# EAGLE schematic Adafrfuit PyBadge (EAGLE 9.2.2)
COMPANY: ADAFRUIT INDUSTRIES; DRAWN: KTOWN; REV: B
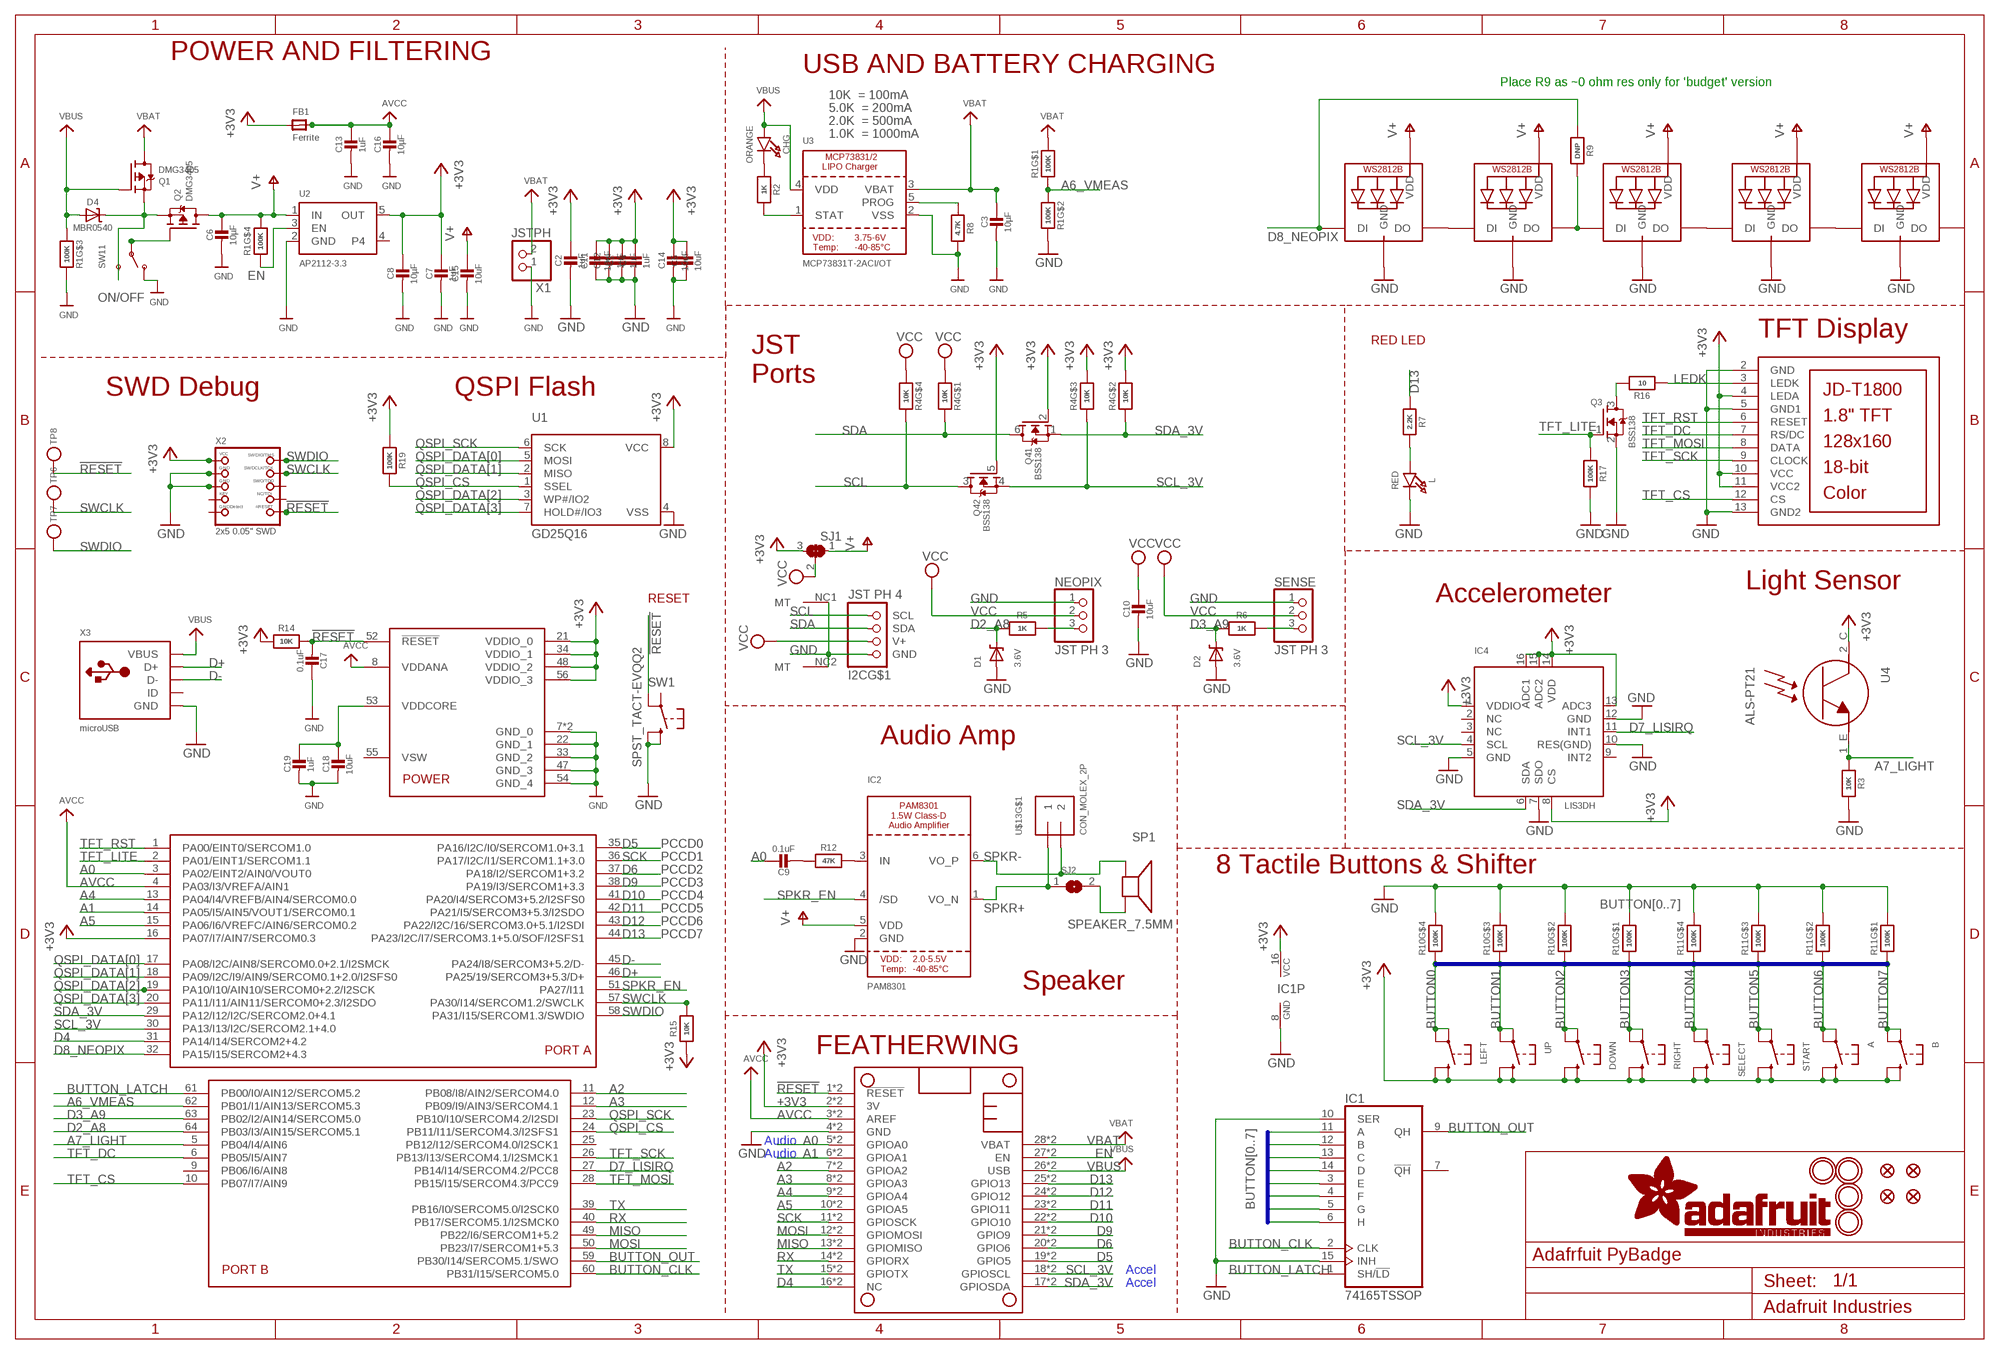
[diagram p0: schematic, sheet 1]

## Parts
A  SWITCH_TACT_SMT_6MMSMALL  [6MM_SMT]
B  SWITCH_TACT_SMT_6MMSMALL  [6MM_SMT]
C1  1uF  CAP_CERAMIC0603_NO  [0603-NO]
C2  1uF  CAP_CERAMIC0603_NO  [0603-NO]
C3  10µF  CAP_CERAMIC0805-NOOUTLINE  [0805-NO]
C4  1uF  CAP_CERAMIC0603_NO  [0603-NO]
C5  10uF  CAP_CERAMIC0805-NOOUTLINE  [0805-NO]
C6  10µF  CAP_CERAMIC0805-NOOUTLINE  [0805-NO]
C7  1uF  CAP_CERAMIC0603_NO  [0603-NO]
C8  10µF  CAP_CERAMIC0805-NOOUTLINE  [0805-NO]
C9  0.1uF  CAP_CERAMIC0603_NO  [0603-NO]
C10  10uF  CAP_CERAMIC0805-NOOUTLINE  [0805-NO]
C11  10uF  CAP_CERAMIC0805-NOOUTLINE  [0805-NO]
C12  1uF  CAP_CERAMIC0603_NO  [0603-NO]
C13  1uF  CAP_CERAMIC0603_NO  [0603-NO]
C14  10uF  CAP_CERAMIC0805-NOOUTLINE  [0805-NO]
C15  10uF  CAP_CERAMIC0805-NOOUTLINE  [0805-NO]
C16  10µF  CAP_CERAMIC_0805MP  [_0805MP]
C17  0.1uF  CAP_CERAMIC0603_NO  [0603-NO]
C18  10uF  CAP_CERAMIC0805-NOOUTLINE  [0805-NO]
C19  1uF  CAP_CERAMIC0603_NO  [0603-NO]
CHG  ORANGE  LED0805_NOOUTLINE  [CHIPLED_0805_NOOUTLINE]
D1  3.6V  DIODE-ZENERSOD323  [SOD-323]
D2  3.6V  DIODE-ZENERSOD323  [SOD-323]
D4  MBR0540  DIODE-SCHOTTKYSOD-123  [SOD-123]
DOWN  SWITCH_TACT_SMT_6MMSMALL  [6MM_SMT]
FB1  Ferrite  FERRITE-0805NO  [0805-NO]
I2C  JST PH 4  STEMMA_I2C_RASMT  [JSTPH4]
IC1  74165TSSOP  [TSSOP16]
IC2  PAM8301  [SOT23-6]
IC4  LIS3DH  ACCEL_LIS3DHTR  [LGA16_3X3MM]
L  RED  LED0805_NOOUTLINE  [CHIPLED_0805_NOOUTLINE]
LCD1  DISP_LCD_JDT1800  [JD-T1800]
LED1  WS2812B3535  [LED3535]
LED2  WS2812B3535  [LED3535]
LED3  WS2812B3535  [LED3535]
LED4  WS2812B3535  [LED3535]
LED5  WS2812B3535  [LED3535]
LEFT  SWITCH_TACT_SMT_6MMSMALL  [6MM_SMT]
MS1  FEATHERWING_SMTDUALNOHOLES  [FEATHERWING_SMT_NOHOLES]
NEOPIX  JST PH 3  CON_JST_PH_3PIN  [JSTPH3]
Q1  DMG3405  MOSFET-P  [SOT23-R]
Q2  DMG3405  MOSFET-P  [SOT23-R]
Q3  BSS138  MOSFET-NWIDE  [SOT23-WIDE]
Q4  BSS138  MOSFET-N_DUAL  [SOT363]
R1  100K  RESISTOR_4PACK  [RESPACK_4X0603]
R2  1K  RESISTOR_0603_NOOUT  [0603-NO]
R3  10K  RESISTOR_0603_NOOUT  [0603-NO]
R4  10K  RESISTOR_4PACK  [RESPACK_4X0603]
R5  1K  RESISTOR_0603_NOOUT  [0603-NO]
R6  1K  RESISTOR_0603_NOOUT  [0603-NO]
R7  2.2K  RESISTOR_0603_NOOUT  [0603-NO]
R8  4.7K  RESISTOR_0603_NOOUT  [0603-NO]
R9  DNP  RESISTOR_0603_NOOUT  [0603-NO]
R10  100K  RESISTOR_4PACK  [RESPACK_4X0603]
R11  100K  RESISTOR_4PACK  [RESPACK_4X0603]
R12  47K  RESISTOR_0603_NOOUT  [0603-NO]
R14  10K  RESISTOR_0603_NOOUT  [0603-NO]
R15  10K  RESISTOR_0603_NOOUT  [0603-NO]
R16  10  RESISTOR_0603_NOOUT  [0603-NO]
R17  100K  RESISTOR_0603_NOOUT  [0603-NO]
R19  100K  RESISTOR_0603_NOOUT  [0603-NO]
RIGHT  SWITCH_TACT_SMT_6MMSMALL  [6MM_SMT]
SELECT  SWITCH_TACT_SMT_6MMSMALL  [6MM_SMT]
SENSE  JST PH 3  CON_JST_PH_3PIN  [JSTPH3]
SJ1  SOLDERJUMPER_2WAY  [SOLDERJUMPER_2WAY_OPEN_NOPASTE]
SJ2  SOLDERJUMPERCLOSED  [SOLDERJUMPER_CLOSEDWIRE]
SP1  SPEAKER_7.5MM  [BUZZER_SMT_7.5MM]
START  SWITCH_TACT_SMT_6MMSMALL  [6MM_SMT]
SW1  SPST_TACT-EVQQ2  SWITCH_TACT_SMT_EVQQ2_SMALL  [EVQ-Q2_SMALLER]
SW11  SWITCH_SPDT  [SPDT_SMT_SSSS811101]
TP6  TESTPOINTROUND2MM  [TESTPOINT_ROUND_2MM]
TP7  TESTPOINTROUND2MM  [TESTPOINT_ROUND_2MM]
TP8  TESTPOINTROUND2MM  [TESTPOINT_ROUND_2MM]
U1  GD25Q16  SPIFLASH_8PIN208MIL  [SOIC8_208MIL]
U2  AP2112-3.3  VREG_SOT23-5  [SOT23-5]
U3  MCP73831T-2ACI/OT  MCP73831/2  [SOT23-5]
U4  ALS-PT21  PHOTOTRANSISTOR_PT26-21C  [ALS-PT26-21C]
U$5  MOUNTINGHOLE3.0THIN  [MOUNTINGHOLE_3.0_PLATEDTHIN]
U$6  MOUNTINGHOLE3.0THIN  [MOUNTINGHOLE_3.0_PLATEDTHIN]
U$13  CON_MOLEX_2P  [53398-0271]
U$15  MOUNTINGHOLE3.0THIN  [MOUNTINGHOLE_3.0_PLATEDTHIN]
U$17  MOUNTINGHOLE3.0THIN  [MOUNTINGHOLE_3.0_PLATEDTHIN]
U$24  ATSAMD51J19  ATSAMD51J  [PQFN64-1]
U$34  FIDUCIAL_1MM  [FIDUCIAL_1MM]
U$35  FIDUCIAL_1MM  [FIDUCIAL_1MM]
U$42  FIDUCIAL_1MM  [FIDUCIAL_1MM]
U$43  FIDUCIAL_1MM  [FIDUCIAL_1MM]
UP  SWITCH_TACT_SMT_6MMSMALL  [6MM_SMT]
X1  JSTPH  CON_JST_PH_2PIN  [JSTPH2]
X2  2x5 0.05" SWD  JTAG-CORTEXBOXPOSTS  [2X05_1.27MM_BOX_POSTS]
X3  microUSB  USB_MICRO_20329_V2  [4UCONN_20329_V2]

## Nets
!RESET: C17.2 MS1.1(!RESET) MS1.1B(!RESET) R14.2 SW1.A'(P1) TP8.P$1 U$24.52(!RESET) X2.10(NRESET)
+3V3 [power]: A.B'(S1) A.B(S) B.B'(S1) B.B(S) C1.1 C2.1 C4.1 C5.1 C7.1 C8.1 C11.1 C12.1 C14.1 DOWN.B'(S1) DOWN.B(S) FB1.1 IC1.16(VCC) IC4.1(VDDIO) IC4.8(CS) IC4.13(ADC3) IC4.14(VDD) IC4.15(ADC2) IC4.16(ADC1) LCD1.4(LEDA) LCD1.10(VCC) LCD1.11(VCC2) LEFT.B'(S1) LEFT.B(S) MS1.2(3V) MS1.2B(3V) Q4.2(1:G) Q4.5(2:G) R4.2 R4.3 R14.1 R15.1 R19.1 RIGHT.B'(S1) RIGHT.B(S) SELECT.B'(S1) SELECT.B(S) SJ1.3 START.B'(S1) START.B(S) U1.8(VCC) U2.5(OUT) U4.2_C(C) U$24.16(PA07/I7/AIN7/SERCOM0.3) U$24.21(VDDIO_0) U$24.34(VDDIO_1) U$24.48(VDDIO_2) U$24.56(VDDIO_3) UP.B'(S1) UP.B(S) X2.1(VCC)
A0: C9.1 MS1.5(GPIOA0) MS1.5B(GPIOA0) U$24.3(PA02/EINT2/AIN0/VOUT0)
A1: MS1.6(GPIOA1) MS1.6B(GPIOA1) U$24.14(PA05/I5/AIN5/VOUT1/SERCOM0.1)
A2: MS1.7(GPIOA2) MS1.7B(GPIOA2) U$24.11(PB08/I8/AIN2/SERCOM4.0)
A3: MS1.8(GPIOA3) MS1.8B(GPIOA3) U$24.12(PB09/I9/AIN3/SERCOM4.1)
A4: MS1.9(GPIOA4) MS1.9B(GPIOA4) U$24.13(PA04/I4/VREFB/AIN4/SERCOM0.0)
A5: MS1.10(GPIOA5) MS1.10B(GPIOA5) U$24.15(PA06/I6/VREFC/AIN6/SERCOM0.2)
A6_VMEAS: R1.1 R1.2 U$24.62(PB01/I1/AIN13/SERCOM5.3)
A7_LIGHT: R3.2 U4.1_E(E) U$24.5(PB04/I4/AIN6)
AVCC: C13.1 C16.1 FB1.2 MS1.3(AREF) MS1.3B(AREF) U$24.4(PA03/I3/VREFA/AIN1) U$24.8(VDDANA)
BUTTON0: IC1.11(A) LEFT.A'(P1) LEFT.A(P) R10.4
BUTTON1: IC1.12(B) R10.3 UP.A'(P1) UP.A(P)
BUTTON2: DOWN.A'(P1) DOWN.A(P) IC1.13(C) R10.2
BUTTON3: IC1.14(D) R10.1 RIGHT.A'(P1) RIGHT.A(P)
BUTTON4: IC1.3(E) R11.4 SELECT.A'(P1) SELECT.A(P)
BUTTON5: IC1.4(F) R11.3 START.A'(P1) START.A(P)
BUTTON6: A.A'(P1) A.A(P) IC1.5(G) R11.2
BUTTON7: B.A'(P1) B.A(P) IC1.6(H) R11.1
BUTTON_CLK: IC1.2(CLK) U$24.60(PB31/I15/SERCOM5.0)
BUTTON_LATCH: IC1.1(SH/!LD) U$24.61(PB00/I0/AIN12/SERCOM5.2)
BUTTON_OUT: IC1.9(QH) U$24.59(PB30/I14/SERCOM5.1/SWO)
CHG_LED: R2.2 U3.1(STAT)
CHG_RATE: R8.1 U3.5(PROG)
D2_: NEOPIX.3 R5.1
D2_A8: D1.C R5.2 U$24.64(PB03/I3/AIN15/SERCOM5.1)
D3_: R6.1 SENSE.3
D3_A9: D2.C R6.2 U$24.63(PB02/I2/AIN14/SERCOM5.0)
D4: MS1.16(NC) MS1.16B(NC) U$24.31(PA14/I14/SERCOM2+4.2)
D5: MS1.19(GPIO5) MS1.19B(GPIO5) U$24.35(PA16/I2C/I0/SERCOM1.0+3.1)
D6: MS1.20(GPIO6) MS1.20B(GPIO6) U$24.37(PA18/I2/SERCOM1+3.2)
D7_LISIRQ: IC4.11(INT1) U$24.27(PB14/I14/SERCOM4.2/PCC8)
D8_NEOPIX: LED1.1(DI) R9.1 U$24.32(PA15/I15/SERCOM2+4.3)
D9: MS1.21(GPIO9) MS1.21B(GPIO9) U$24.38(PA19/I3/SERCOM1+3.3)
D10: MS1.22(GPIO10) MS1.22B(GPIO10) U$24.41(PA20/I4/SERCOM3+5.2/I2SFS0)
D11: MS1.23(GPIO11) MS1.23B(GPIO11) U$24.42(PA21/I5/SERCOM3+5.3/I2SDO)
D12: MS1.24(GPIO12) MS1.24B(GPIO12) U$24.43(PA22/I2C/16/SERCOM3.0+5.1/I2SDI)
D13: MS1.25(GPIO13) MS1.25B(GPIO13) R7.1 U$24.44(PA23/I2C/I7/SERCOM3.1+5.0/SOF/I2SFS1)
D+: U$24.46(PA25/19/SERCOM3+5.3/D+) X3.D+
D-: U$24.45(PA24/I8/SERCOM3+5.2/D-) X3.D-
EN: MS1.27(EN) MS1.27B(EN) R1.4 U2.3(EN)
GND: C1.2 C2.2 C3.2 C4.2 C5.2 C6.2 C7.2 C8.2 C10.2 C11.2 C12.2 C13.2 C14.2 C15.2 C16.2 C17.1 C18.2 C19.2 D1.A D2.A I2C.1(GND) I2C.NC1(MT) I2C.NC2(MT) IC1.8(GND) IC1.10(SER) IC1.15(INH) IC2.2(GND) IC4.5(GND) IC4.7(SDO) IC4.10(RES(GND)) IC4.12(GND) L.C LCD1.2(GND) LCD1.5(GND1) LCD1.13(GND2) LED1.4(GND) LED2.4(GND) LED3.4(GND) LED4.4(GND) LED5.4(GND) MS1.4(GND) MS1.4B(GND) NEOPIX.1 Q3.2(S) R1.6 R1.7 R3.1 R8.2 R10.5 R10.6 R10.7 R10.8 R11.5 R11.6 R11.7 R11.8 R17.2 SENSE.1 SW1.B'(S1) SW1.B(S) SW11.A(O) U1.4(VSS) U2.2(GND) U3.2(VSS) U$24.7(GND_0) U$24.22(GND_1) U$24.33(GND_2) U$24.47(GND_3) U$24.54(GND_4) U$24.EXP(GND_0) X1.1 X2.3(GND) X2.5(GND) X3.BASE@1(GND) X3.BASE@2(GND) X3.GND X3.SPRT@1(GND) X3.SPRT@2(GND) X3.SPRT@3(GND) X3.SPRT@4(GND)
LEDK: LCD1.3(LEDK) R16.1
MISO: MS1.13(GPIOMISO) MS1.13B(GPIOMISO) U$24.49(PB22/I6/SERCOM1+5.2)
MOSI: MS1.12(GPIOMOSI) MS1.12B(GPIOMOSI) U$24.50(PB23/I7/SERCOM1+5.3)
N$1: CHG.C R2.1
N$2: L.A R7.2
N$3: LED1.3(DO) LED2.1(DI)
N$4: LED2.3(DO) LED3.1(DI) R9.2
N$5: LED3.3(DO) LED4.1(DI)
N$6: Q3.3(D) R16.2
N$7: LED4.3(DO) LED5.1(DI)
N$8: D4.C Q1.2(S) Q2.2(S) SW11.C(S)
N$9: C9.2 R12.1
N$10: IC2.3(IN) R12.2
N$12: SJ2.2 SP1.-
ON/OFF: Q2.1(G) SW11.B(P)
QSPI_CS: R19.2 U1.1(SSEL) U$24.24(PB11/I11/SERCOM4.3/I2SFS1)
QSPI_DATA[0]: U1.5(MOSI) U$24.17(PA08/I2C/AIN8/SERCOM0.0+2.1/I2SMCK)
QSPI_DATA[1]: U1.2(MISO) U$24.18(PA09/I2C/I9/AIN9/SERCOM0.1+2.0/I2SFS0)
QSPI_DATA[2]: U1.3(WP#/IO2) U$24.19(PA10/I10/AIN10/SERCOM0+2.2/I2SCK)
QSPI_DATA[3]: U1.7(HOLD#/IO3) U$24.20(PA11/I11/AIN11/SERCOM0+2.3/I2SDO)
QSPI_SCK: U1.6(SCK) U$24.23(PB10/I10/SERCOM4.2/I2SDI)
RX: MS1.14(GPIORX) MS1.14B(GPIORX) U$24.40(PB17/SERCOM5.1/I2SMCK0)
SCK: MS1.11(GPIOSCK) MS1.11B(GPIOSCK) U$24.36(PA17/I2C/I1/SERCOM1.1+3.0)
SCL: I2C.4(SCL) Q4.3(2:D) R4.5
SCL_3V: IC4.4(SCL) MS1.18(GPIOSCL) MS1.18B(GPIOSCL) Q4.4(2:S) R4.6 U$24.30(PA13/I13/I2C/SERCOM2.1+4.0)
SDA: I2C.3(SDA) Q4.6(1:D) R4.8
SDA_3V: IC4.6(SDA) MS1.17(GPIOSDA) MS1.17B(GPIOSDA) Q4.1(1:S) R4.7 U$24.29(PA12/I12/I2C/SERCOM2.0+4.1)
SPKR+: IC2.1(VO_N) SJ2.1 U$13.1
SPKR-: IC2.6(VO_P) SP1.+ U$13.2
SPKR_EN: IC2.4(/SD) U$24.51(PA27/I11)
SWCLK: R15.2 TP6.P$1 U$24.57(PA30/I14/SERCOM1.2/SWCLK) X2.4(SWDCLK)
SWDIO: TP7.P$1 U$24.58(PA31/I15/SERCOM1.3/SWDIO) X2.2(SWDIO)
TFT_CS: LCD1.12(CS) U$24.10(PB07/I7/AIN9)
TFT_DC: LCD1.7(RS/DC) U$24.6(PB05/I5/AIN7)
TFT_LITE: Q3.1(G) R17.1 U$24.2(PA01/EINT1/SERCOM1.1)
TFT_MOSI: LCD1.8(DATA) U$24.28(PB15/I15/SERCOM4.3/PCC9)
TFT_RST: LCD1.6(RESET) U$24.1(PA00/EINT0/SERCOM1.0)
TFT_SCK: LCD1.9(CLOCK) U$24.26(PB13/I13/SERCOM4.1/I2SMCK1)
TX: MS1.15(GPIOTX) MS1.15B(GPIOTX) U$24.39(PB16/I0/SERCOM5.0/I2SCK0)
V+ [power]: C6.1 C15.1 IC2.5(VDD) LED1.2(VDD) LED2.2(VDD) LED3.2(VDD) LED4.2(VDD) LED5.2(VDD) Q2.3(D) R1.5 SJ1.1 U2.1(IN)
VBAT [power]: C3.1 MS1.28(VBAT) MS1.28B(VBAT) Q1.3(D) R1.8 U3.3(VBAT) X1.2
VBUS: CHG.A D4.A MS1.26(USB) MS1.26B(USB) Q1.1(G) R1.3 U3.4(VDD) X3.VBUS
VCC [power]: C10.1 I2C.2(V+) NEOPIX.2 R4.1 R4.4 SENSE.2 SJ1.2
VDDCORE2: C18.1 C19.1 U$24.53(VDDCORE)
Unconnected: IC1.7(!QH) IC4.2(NC) IC4.3(NC) IC4.9(INT2) LED5.3(DO) SW1.A(P) U2.4 U$13.M1(MT) U$13.M2(MT) U$24.9(PB06/I6/AIN8) U$24.25(PB12/I12/SERCOM4.0/I2SCK1) U$24.55(VSW) X2.6(SWO) X2.7(KEY) X2.8(TDI) X2.9(GNDDETECT) X3.ID

## Buses
BUTTON[0..7]

## Notes on the sheet
- POWER AND FILTERING
- USB AND BATTERY CHARGING
- Place R9 as ~0 ohm res only for 'budget' version
- 10K  = 100mA
- 5.0K  = 200mA
- 2.0K  = 500mA
- 1.0K  = 1000mA
- TFT Display
- RED LED
- JST
  Ports
- SWD Debug | QSPI Flash
- Light Sensor
- RESET | Accelerometer
- Audio Amp
- PCCD0
- PCCD1
- PCCD2 | 8 Tactile Buttons & Shifter
- PCCD3
- PCCD4
- PCCD5
- PCCD6
- PCCD7
- Speaker
- FEATHERWING
- Audio
- Audio
- Accel
- Accel

## Library data of the parts
A B DOWN LEFT RIGHT SELECT START SW1 UP = microbuilder:SWITCH_TACT_SMT: SMT Tact Switches 6x6mm - Digikey: P12940SCT-ND KMR2 (4.6x2.8mm) - Digikey: 401-1426-1-ND EVQ-PQHB55 - Light Touch, 160GF (4.5x4.5mm) - Digikey: P8090SCT-ND KMT0 - KMT021 NGJ LHS (etc.) IP68/Waterproof - Digikey: CKN10289CT-ND
C1-C19 = microbuilder:CAP_CERAMIC: Ceramic Capacitors For new designs, use the packages preceded by an '_' character since they are more reliable: The following footprints should be used on most boards: _0402 - Standard footprint for regular board layouts _0603 - Standard footprint for regular board layouts _0805 - Standard footprint for regular board layouts _1206 - Standard footprint for regular board layouts For extremely tight-pitch boards where space is at a premium, the following 'micro-pitch' footprints can be used (smaller pads, no silkscreen outline, etc.): _0402MP - Micro-pitch footprint for very dense/compact boards _0603MP - Micro-pitch footprint for very dense/compact boards _0805MP - Micro-pitch footprint for very dense/compact boards _1206MP - Micro-pitch footprint for very dense/compact boards
CHG L = microbuilder:LED: LED 0603 - 0603 Surface Mount Package 2mA: Green LED - Low Power (3.9mcd, 2ma, 1.7Vf) - Digikey: 475-2709-2-ND Orange LED - Low Power (9.8mcd, 2ma, 1.8Vf) - Digikey: 475-1194-2-ND Red LED - Low Power (5mcd, 2ma, 1.8Vf) - Digikey: 475-1195-2-ND Yellow LED - Low Power (7mcd, 2ma, 1.8Vf) - Digikey: 475-1196-2-ND 5mA: Blue LED - Low Power (17mcd, 5ma, 2.9Vf) - Digikey: LNJ937W8CRACT-ND 0805 - 0805 Surface Mount Package 2mA: Red LED (8.8mcd, 2mA, 1.8Vf, Clear) - Low Power [Digikey: 475-2510-1-ND] Green LED (5mcd, 2mA, 1.8Vf, Clear) - Low Power [Digikey: 475-2730-1-ND] Yellow LED (11.3mcd, 2mA, 1.8Vf, Clear) - Low Power [Digikey: 475-2555-1-ND] 20mA: Red LED (104mcd, 20mA, Diffused) - LS R976 [Digikey: 475-1278-6-ND] Red LED (12mcd, 20mA, 2.0Vf, Clear) - APT2012EC [Digikey: 754-1128-1-ND] Green LED (15mcd, 20mA, 2.2Vf, Clear) - APT2012GC [Digikey: 754-1131-1-ND] Orange LED (160mcd, 20mA, 2.1Vf, Clear) - APT2012SECK [Digikey: 754-1130-1-ND] 1206 - 1206 Surface Mount Package Green LED (26mcd, 20mA, Diffused) - LG N971 [Digikey: 475-1407-6-ND] Red LED (15mcd, 20mA, Diffused) - LH N974 [Digikey: 475-1416-6-ND] Cree - Cree High-Power Surface Mount LEDs XPEBWT-L1-0000-00D50 - White 111lm 350mA 2.9Vf 6200K 110° XTEAWT-00-0000-00000LEE3 - White 114lm 350mA 2.85Vf 5000K 115° Everlight - Everlight 45-21 Series Surface Mount LEDs 45-21/QK2C-B2832AC2CB2/2T - Warm White 2000mcd 20mA 3.25Vf 3050K 120° 45-21/LK2C-B38452C4CB2/2T - Nuetral White 2000mcd 20mA 3.25Vf 4150K 120° 45-21/LK2C-B50634C6CB2/2T - Cold White 2200mcd 20mA 3.25Vf 5650K 120° PLCC2 Reverse Mount LS T77K-J1L2-1-0-2-R18-Z - Red 11.25mcd 2mA 1.8Vf 630nm 120° LO T77K-L1M2-24-Z - Orange 19.6mcd 2mA 1.8Vf 606nm 120° LY T77K-K2M1-26-Z - Yellow 15.7mcd 2mA 1.8Vf 587nm 120°
D1 D2 = microbuilder:DIODE-ZENER: Zener Diode SMA: 30V 1W Zener Diode, 1.2Vf - Digikey: SMAZ30-FDICT-ND
D4 = microbuilder:DIODE-SCHOTTKY
FB1 = microbuilder:FERRITE: Ferrite Bead 0603 MMZ1608B121C - 120 Ohm @ 100MHz, 600mA, 0.15 Ohm DC Resistance - Digikey: 445-2164-1-ND BK1608HW121-T - 120 Ohm, 600mA Ferrite Chip - Digikey: 587-1876-2-ND 0805 HZ0805B272R-10 - 2.7K Ohm @ 100MHz, 200mA, 0.8 Ohm DC Resistance - Digikey: 240-2504-1-ND (see also Murata BLM21BD272SN1L) MMZ2012Y152B - 1.5K Ohm @ 100MHz, 500mA, 0.4 Ohm DC Resistance - Digikey: 445-1560-1-ND - Mainly for high frequency (80-400MHz) MMZ2012R102A - 1K Ohm @ 100MHz, 500mA, 0.3 Ohm DC Resistance - Digikey: 445-1555-2-ND - More general purpose (10-200MHz)
I2C = microbuilder:STEMMA_I2C
IC1 = microbuilder:74*165: 8-bit parallel load SHIFT REGISTER
IC2 = microbuilder:PAM8301
IC4 = microbuilder:ACCEL_LIS3DHTR: LIS3DHTR 3-Axis Accelerometer with I2C/SPI Interface VDD: 1.71-3.6V VDDIO: 1.71-VDD+0.1V Scale: +/-2g, 4g, 8g, 16g with 16--bit data output Temp:: -40°C - 85°C Mouser: 511-LIS3DHTR Digikey: 497-10613-1-ND
LCD1 = microbuilder:DISP_LCD_JDT1800
LED1-LED5 = microbuilder:WS2812B
MS1 = microbuilder:FEATHERWING
NEOPIX SENSE = microbuilder:CON_JST_PH_3PIN
Q1 Q2 = microbuilder:MOSFET-P: P-Channel Mosfet LEGEND VDS: Voltage Drain-Source ID: Drain Current RDS(ON): Drain-Source On-State Resistance VGS(TH): Gate-Source Threshold Voltage CISS: Drain-Source Input Capacitance SOT-23 Name VDS ID RDS(ON) VGS(TH) CISS Order Number IRLML5103 30V 760mA 600 mOhm -- 75pF @ 25V Digikey: IRLML5103PBFCT-ND IRLML6401 12V 4.3A 50 mOhm 950mV @ 250µA 830pF @ 10V Digikey: IRLML6401PBFTR-ND NTR0202PL 20V 400mA 800 mOhm 2.3V @ 250uA 70pF @ 5V Digikey: NTR0202PLT1GOSTR-ND NTR4101PT1G 20V 1.8A 85 mOhm 1.2V @ 250uA 675pF @ 10V Digikey: NTR4101PT1GOSCT-ND DMP2004K 20V 600mA 900 mOhm 1V @ 250uA 175pF @ 16V Digikey: DMP2004KDICT-ND PMV65XP 20V 3.9A 76 mOhm 950mV @ 1mA 725pF @ 20V Digikey: 568-2358-2-ND TO-252 Name VDS ID RDS(ON) VGS(TH) CISS Order Number AOD417 30V 25A 34 mOhm 3V @ 250µA 920pF @ 15V Digikey: 785-1106-2-ND PowerPak Name VDS ID RDS(ON) VGS(TH) CISS Order Number AON7401 30V 12A 14 mOhm 3V @ 250µA 2600pF @ 15V Digikey: 785-1302-1-ND
Q3 = microbuilder:MOSFET-N: N-Channel Mosfet LEGEND VDS: Voltage Drain-Source ID: Drain Current RDS(ON): Drain-Source On-State Resistance VGS(TH): Gate-Source Threshold Voltage CISS: Drain-Source Input Capacitance SOT-23 Name VDS ID RDS(ON) VGS(TH) CISS Order Number 2N7002E 60V 260mA 2.5 Ohm 2.5V @ 250uA 26.7pF @ 25V 2N7002ET1GOSTR-ND BSH103 30V 850mA 400 mOhm 400mV @ 1mA 83pF @ 24V BSH103,235-ND BSS138 60V 320mA 1.6 Ohm 1.5V @ 250uA 50pF @ 10V Mouser: 771-BSS138PW115 DMN2075U-7 20V 4.2A 38 mOhm 1V @ 250 uA 594.3pF @ 10V DMN2075U-7DICT-ND * BSS138 good choice for I2C level-shifting POWERPAK 1212-8 Name VDS ID RDS(ON) VGS(TH) CISS Order Number Si7308DN 60V 6A 58 mOhm 3V @ 250uA 665pF @ 15V SI7308DN-T1-E3CT-ND
Q4 = microbuilder:MOSFET-N_DUAL: Dual N-Channel MOSFET SOT363 (2.0x1.25mm) 2N7002PS - 60V, 320mA [Digikey: 568-5984-1-ND]
R1 R4 R10 R11 = microbuilder:RESISTOR_4PACK: Resistor Packs (4 resistors) 4 x 0603 10K 1/16W - Digikey: YC164J-10KCT-ND
R2 R3 R5-R9 R12 R14-R17 R19 = microbuilder:RESISTOR: Resistors For new designs, use the packages preceded by an '_' character since they are more reliable: The following footprints should be used on most boards: _0402 - Standard footprint for regular board layouts _0603 - Standard footprint for regular board layouts _0805 - Standard footprint for regular board layouts _1206 - Standard footprint for regular board layouts For extremely tight-pitch boards where space is at a premium, the following 'micro-pitch' footprints can be used (smaller pads, no silkscreen outline, etc.): _0402MP - Micro-pitch footprint for very dense/compact boards _0603MP - Micro-pitch footprint for very dense/compact boards _0805MP - Micro-pitch footprint for very dense/compact boards _1206MP - Micro-pitch footprint for very dense/compact boards
SJ1 = microbuilder:SOLDERJUMPER_2WAY: 2-Way Solder Jumper
SJ2 = microbuilder:SOLDERJUMPER: SMD Solder JUMPER Solder the two pads together to create a connection, or remove the solder to break it. REFLOW - Use this footprint for solder paste and reflow ovens. WAVE - Use this footprint for hand-soldering (larger pads). CLOSED - Has a trace between the two pads to ensure it is closed by default. The trace needs to be cut to disable the jumper, and can be closed again by creating a solder bridge between the two pads.
SP1 = microbuilder:SPEAKER: SPEAKER Source: Buerklin Added PS12 (for part # PS1240 piezo) http://www.ladyada.net/library/pcb/eaglelibrary.html
SW11 = microbuilder:SWITCH_SPDT: Switch - SPDT SSSS811101 - Horizontal Two Position SMT, 0.3A 4V [Mouser: 688-SSSS811101]
TP6-TP8 = microbuilder:TESTPOINT: Test Point Various test points for characterisation and PCB testing TESTPOINT_SMT - Compact Surface Mount Test Point [Digikey: 5016KTR-ND]
U1 = microbuilder:SPIFLASH_8PIN: SOIC8 SPI Flash Be careful with the size since SOIC8 flash comes in several 'widths' SOIC8 150 mil M25P16 - 16Mbit (2Mbit x 8) Serial Flash (75MHz SPI Bus), Supply: 2.7-3.6V Digikey: SOIC8 - M25P16-VMN6P-ND SOIC8 208 mil W25Q16BVSSIG - 16Mbit (2Mbit x 8) Serial Flash (104MHz SPI Bus), Supply: 2.7-3.6V Digikey: SOIC8 - W25Q16BVSSIG-ND
U2 = microbuilder:VREG_SOT23-5: SOT23-5 Fixed Voltage Regulators Part Current Out V Out V In V Dropout θJA (°C/W) TJ (°C) Digikey Part No. ADP121 150mA 3.3V 3.4-5.5V 0.09V @ 150mA -- -- ADP121-AUJZ33R7CT-ND ADP121 150mA 3.0V 3.1-5.5V 0.09V @ 150mA -- -- ADP121-AUJZ30R7CT-ND ADP122 300mA 3.3V 3.4-5.5V 0.085V @ 300mA -- -- ADP122AUJZ-3.3-R7CT-ND ADP1712 300mA 3.3V 3.5-5.5V 0.17V @ 300mA -- -- ADP1712AUJZ-3.3-R7TR-ND AP7311 (Low Cost) 150mA 3.3V 3.5-6V 0.15V @ 150mA -- -- AP7311-33WG-7DICT-ND LD39015M18R 150mA 1.8V 1.9V-5.5V 0.08V @ 100mA -- -- 497-6977-1-ND LP2985A-33DBVR 150mA 3.3V 3.3-16V 0.28V @ 150mA 206 150 296-18479-1-ND MCP1824T-3302E/OT 300mA 3.3V 3.5V-6V 0.2V @ 300mA -- -- MCP1824T-3302E/OTCT-ND MIC5205-2.5YM5 TR 150mA 2.5V 2.7-16V 0.165V @ 150mA -- -- 576-1257-2-ND MIC5205-3.0YM5 TR 150mA 3.0V 3.2V-16V 0.165V @ 150mA -- -- 576-1258-2-ND MIC5205-3.3YM5 TR 150mA 3.3V 3.5V-16V 0.165V @ 150mA -- -- 576-1259-2-ND TPS780330220 150mA 3.3V+2.2V 3.6-5.5V 250mV Max -- -- 296-23332-1-ND TDA3663/N1,135 100mA 3.3V 3.5-45V 0.18V @ 50mA -- -- 568-5343-1-ND Max operating temp can be calculated using θJA, TJ (max junction temperature), and power in watts. Set the "Maximum Ambient Temperature" until it reaches TJ ("Max Junction Temperature"), which is the absolute limit for safe use of the regulator: Heat Sink Temperature Calculator <http://www.daycounter.com/Calculators/Heat-Sink-Temperature-Calculator.phtml> For example, With 12V source into a 3.3V LP2985 and a 30mA load, we are dissipating (12V-3.3V) * 0.03A = 0.261W. With a θJA of 206 °C/W, a TJ of 150°C, and 261mW we can safely use the chip without a heat sink up to 75°C (=147.1°C Junction Temperature).
U3 = microbuilder:MCP73831/2: MCP73831/2 LIPO Charger VDD: 3.75 - 6V Temp -40 - 85°C Programmable Charge Rate: 15-500mA NOTE: STAT is a tri-state logic output on the MCP73831 and an open-drain output on the MCP73832. SOT23-5 with 4.2V output and tri-state logic on STAT = MCP73831T-2ACI/OT
U4 = microbuilder:PHOTOTRANSISTOR: ALS-PT19-315C - Analog Light Sensor VCC: 2.5-5.5V
U$5 U$6 U$15 U$17 = microbuilder:MOUNTINGHOLE: Mounting Hole For #2 screws (0.086"/2.18mm width, 0.094"/2.4mm hole) use 2.5mm; BOM: EXCLUDE
U$13 = microbuilder:CON_MOLEX_2P
U$24 = microbuilder:ATSAMD51J: ATSAMD51J cortex m4 microcontroller
U$34 U$35 U$42 U$43 = microbuilder:FIDUCIAL: Fiducial Alignment Points Various fiducial points for machine vision alignment.; BOM: EXCLUDE
X1 = microbuilder:CON_JST_PH_2PIN: JST 2-Pin Right-Angle Connector PH-Series - 4UConnector: 17311 SH-Series - 4UConnector: 07278
X2 = microbuilder:JTAG-CORTEX: Serial Wire (SW-DP) Connector Standard 0.05" 10-pin connector is for use with the Cortex M and Cortex A SWD (serial wire debugger) interface (SW-DP) Connectors 2x05_1.27MM_SMT - Inexpensive surface-mount header with bare pins, compatible with standard 10-pin SWD cables (4UCON: 16846) 2x05_1.27MM_BOX_NOPOSTS - Polarised surface-mount box (4UCON with caps: 19735, without caps: 15117 2x05_1.27MM_BOX_POSTS - Polarised surface-mount box with mounting holes (4UCON: 20317) Pinout: http://infocenter.arm.com/help/topic/com.arm.doc.faqs/attached/13634/cortex_debug_connectors.pdf http://www.keil.com/peripherals/coresight/connectors.asp
X3 = microbuilder:USB: USB Connectors USBMINIB - Surface Mount Female Mini-B USB Connector 4UConnector: 06564

## Net classes
1 power: width 0.305 mm
2 gnd: width 0.254 mm